# EAGLE design Blinkytile tester (EAGLE 7.1.0)
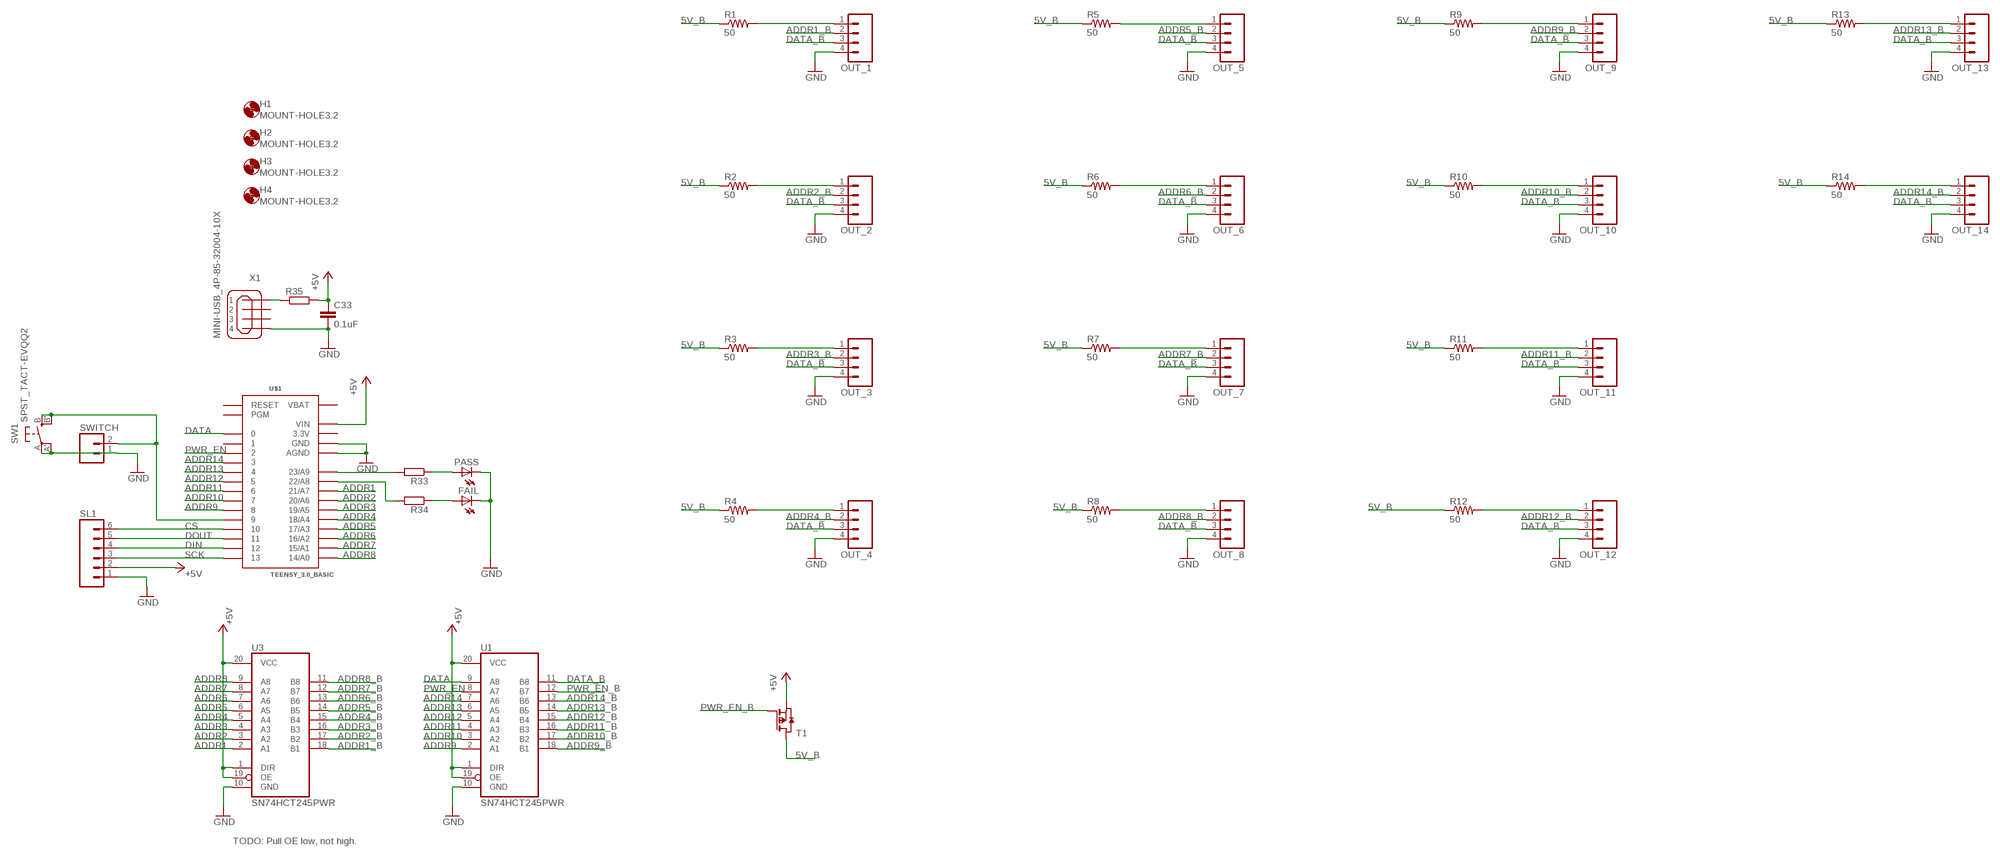
[diagram p0: schematic, sheet 1]

## Parts
C33  0.1uF  C-EUC0805  [C0805]
FAIL  LED5MM  [LED5MM]
H1  MOUNT-HOLE3.2  [3,2]
H2  MOUNT-HOLE3.2  [3,2]
H3  MOUNT-HOLE3.2  [3,2]
H4  MOUNT-HOLE3.2  [3,2]
OUT_1  M04  [04P]
OUT_2  M04  [04P]
OUT_3  M04  [04P]
OUT_4  M04  [04P]
OUT_5  M04  [04P]
OUT_6  M04  [04P]
OUT_7  M04  [04P]
OUT_8  M04  [04P]
OUT_9  M04  [04P]
OUT_10  M04  [04P]
OUT_11  M04  [04P]
OUT_12  M04  [04P]
OUT_13  M04  [04P]
OUT_14  M04  [04P]
PASS  LED5MM  [LED5MM]
R1  50  R-US_R0603  [R0603]
R2  50  R-US_R0603  [R0603]
R3  50  R-US_R0603  [R0603]
R4  50  R-US_R0603  [R0603]
R5  50  R-US_R0603  [R0603]
R6  50  R-US_R0603  [R0603]
R7  50  R-US_R0603  [R0603]
R8  50  R-US_R0603  [R0603]
R9  50  R-US_R0603  [R0603]
R10  50  R-US_R0603  [R0603]
R11  50  R-US_R0603  [R0603]
R12  50  R-US_R0603  [R0603]
R13  50  R-US_R0603  [R0603]
R14  50  R-US_R0603  [R0603]
R33  R-EU_M0805  [M0805]
R34  R-EU_M0805  [M0805]
R35  R-EU_M0805  [M0805]
SL1  M06  [06P]
SW1  SPST_TACT-EVQQ2  [EVQ-Q2]
SWITCH  M02  [02P]
T1  PMOSSOT223  [SOT223]
U1  SN74HCT245PWR  74245PW  [TSSOP20]
U3  SN74HCT245PWR  74245PW  [TSSOP20]
U$1  TEENSY_3.0_BASIC  [TEENSY_3.0_BASIC]
X1  MINI-USB_4P-85-32004-10X  [85-32004-10X]

## Nets
5V_B: R1.1 R2.1 R3.1 R4.1 R5.1 R6.1 R7.1 R8.1 R9.1 R10.1 R11.1 R12.1 R13.1 R14.1 T1.2(D) T1.4(D)
+5V: C33.1 R35.2 SL1.2 T1.3(S) U1.1(DIR) U1.19(OE) U1.20(VCC) U3.1(DIR) U3.19(OE) U3.20(VCC) U$1.VIN
ADDR1: U3.2(A1) U$1.21/A7
ADDR1_B: OUT_1.2 U3.18(B1)
ADDR2: U3.3(A2) U$1.20/A6
ADDR2_B: OUT_2.2 U3.17(B2)
ADDR3: U3.4(A3) U$1.19/A5
ADDR3_B: OUT_3.2 U3.16(B3)
ADDR4: U3.5(A4) U$1.18/A4
ADDR4_B: OUT_4.2 U3.15(B4)
ADDR5: U3.6(A5) U$1.17/A3
ADDR5_B: OUT_5.2 U3.14(B5)
ADDR6: U3.7(A6) U$1.16/A2
ADDR6_B: OUT_6.2 U3.13(B6)
ADDR7: U3.8(A7) U$1.15/A1
ADDR7_B: OUT_7.2 U3.12(B7)
ADDR8: U3.9(A8) U$1.14/A0
ADDR8_B: OUT_8.2 U3.11(B8)
ADDR9: U1.2(A1) U$1.8
ADDR9_B: OUT_9.2 U1.18(B1)
ADDR10: U1.3(A2) U$1.7
ADDR10_B: OUT_10.2 U1.17(B2)
ADDR11: U1.4(A3) U$1.6
ADDR11_B: OUT_11.2 U1.16(B3)
ADDR12: U1.5(A4) U$1.5
ADDR12_B: OUT_12.2 U1.15(B4)
ADDR13: U1.6(A5) U$1.4
ADDR13_B: OUT_13.2 U1.14(B5)
ADDR14: U1.7(A6) U$1.3
ADDR14_B: OUT_14.2 U1.13(B6)
CS: SL1.6 U$1.10
DATA: U1.9(A8) U$1.0
DATA_B: OUT_1.3 OUT_2.3 OUT_3.3 OUT_4.3 OUT_5.3 OUT_6.3 OUT_7.3 OUT_8.3 OUT_9.3 OUT_10.3 OUT_11.3 OUT_12.3 OUT_13.3 OUT_14.3 U1.11(B8)
DIN: SL1.4 U$1.12
DOUT: SL1.5 U$1.11
GND: C33.2 FAIL.K(C) OUT_1.4 OUT_2.4 OUT_3.4 OUT_4.4 OUT_5.4 OUT_6.4 OUT_7.4 OUT_8.4 OUT_9.4 OUT_10.4 OUT_11.4 OUT_12.4 OUT_13.4 OUT_14.4 PASS.K(C) SL1.1 SW1.A'(P1) SW1.A(P) SWITCH.1 U1.10(GND) U3.10(GND) U$1.AGND U$1.GND U$1.GND1(GND) X1.4
GOOD: PASS.A R33.1
N$1: OUT_5.1 R5.2
N$2: OUT_1.1 R1.2
N$3: SW1.B'(S1) SW1.B(S) SWITCH.2 U$1.9
N$4: OUT_2.1 R2.2
N$8: OUT_3.1 R3.2
N$11: OUT_4.1 R4.2
N$17: OUT_6.1 R6.2
N$20: OUT_7.1 R7.2
N$23: OUT_8.1 R8.2
N$26: OUT_9.1 R9.2
N$29: OUT_10.1 R10.2
N$32: OUT_11.1 R11.2
N$38: OUT_13.1 R13.2
N$41: OUT_14.1 R14.2
N$44: OUT_12.1 R12.2
N$49: R33.2 U$1.23/A9
N$50: R34.2 U$1.22/A8
N$52: FAIL.A R34.1
N$53: R35.1 X1.1
PWR_EN: U1.8(A7) U$1.2
PWR_EN_B: T1.1(G) U1.12(B7)
SCK: SL1.3 U$1.13
Unconnected: U$1.1 U$1.PGM U$1.RESET X1.2 X1.3

## Notes on the sheet
- TODO: Pull OE low, not high.

## Power pins joined to a net without a drawn wire
3.3V: U$1.3.3V U$1.3.3V1(3.3V)
VBAT: U$1.VBAT

## Library data of the parts
C33 = rcl:C-EU: CAPACITOR, European symbol
FAIL PASS = adafruit:LED: LED OSRAM: - CHIPLED LG R971, LG N971, LY N971, LG Q971, LY Q971, LO R971, LY R971 LH N974, LH R974 LS Q976, LO Q976, LY Q976 LO Q996 - Hyper CHIPLED LW Q18S LB Q993, LB Q99A, LB R99A - SideLED LS A670, LO A670, LY A670, LG A670, LP A670 LB A673, LV A673, LT A673, LW A673 LH A674 LY A675 LS A676, LA A676, LO A676, LY A676, LW A676 LS A679, LY A679, LG A679 - Hyper Micro SIDELED® LS Y876, LA Y876, LO Y876, LY Y876 LT Y87S - SmartLED LW L88C, LW L88S LB L89C, LB L89S, LG L890 LS L89K, LO L89K, LY L89K LS L896, LA L896, LO L896, LY L896 - TOPLED LS T670, LO T670, LY T670, LG T670, LP T670 LSG T670, LSP T670, LSY T670, LOP T670, LYG T670 LG T671, LOG T671, LSG T671 LB T673, LV T673, LT T673, LW T673 LH T674 LS T676, LA T676, LO T676, LY T676, LB T676, LH T676, LSB T676, LW T676 LB T67C, LV T67C, LT T67C, LS T67K, LO T67K, LY T67K, LW E67C LS E67B, LA E67B, LO E67B, LY E67B, LB E67C, LV E67C, LT E67C LW T67C LS T679, LY T679, LG T679 LS T770, LO T770, LY T770, LG T770, LP T770 LB T773, LV T773, LT T773, LW T773 LH T774 LS E675, LA E675, LY E675, LS T675 LS T776, LA T776, LO T776, LY T776, LB T776 LHGB T686 LT T68C, LB T68C - Hyper Mini TOPLED® LB M676 - Mini TOPLED Santana® LG M470 LS M47K, LO M47K, LY M47K Source: http://www.osram.convergy.de/
H1-H4 = holes:MOUNT-HOLE: MOUNTING HOLE with drill center marker
OUT_1-OUT_14 = con-amp-quick:M04: AMP QUICK CONNECTOR; OC_FARNELL: unknown; OC_NEWARK: unknown
R1-R14 = adafruit:R-US_: RESISTOR, American symbol
R33-R35 = rcl:R-EU_: RESISTOR, European symbol
SL1 = con-amp-quick:M06: AMP QUICK CONNECTOR; OC_FARNELL: unknown; OC_NEWARK: unknown
SW1 = adafruit:SPST_TACT: SMT 6mm switch, EVQQ2 series http://www.ladyada.net/library/eagle
SWITCH = con-amp-quick:M02: AMP QUICK CONNECTOR; OC_FARNELL: unknown; OC_NEWARK: unknown
T1 = zetex:PMOSSOT223: MOS FET; OC_FARNELL: unknown; OC_NEWARK: unknown
U1 U3 = scanlime:74*245: Octal BUS TRANSCEIVER, 3-state
U$1 = Teensy3.0:TEENSY_3.0_BASIC: Basic Teensy 3.0 with none of the 'inner' pins enabled. See '+4', 'AllAnalogPins", and 'AllPins' packages for additional pin holes, as needed.
X1 = con-cypressindustries:MINI-USB_4P-: MINI USB 4 Pol. Source: www.cypressindustries.com; OC_FARNELL: unknown; OC_NEWARK: unknown

## Board
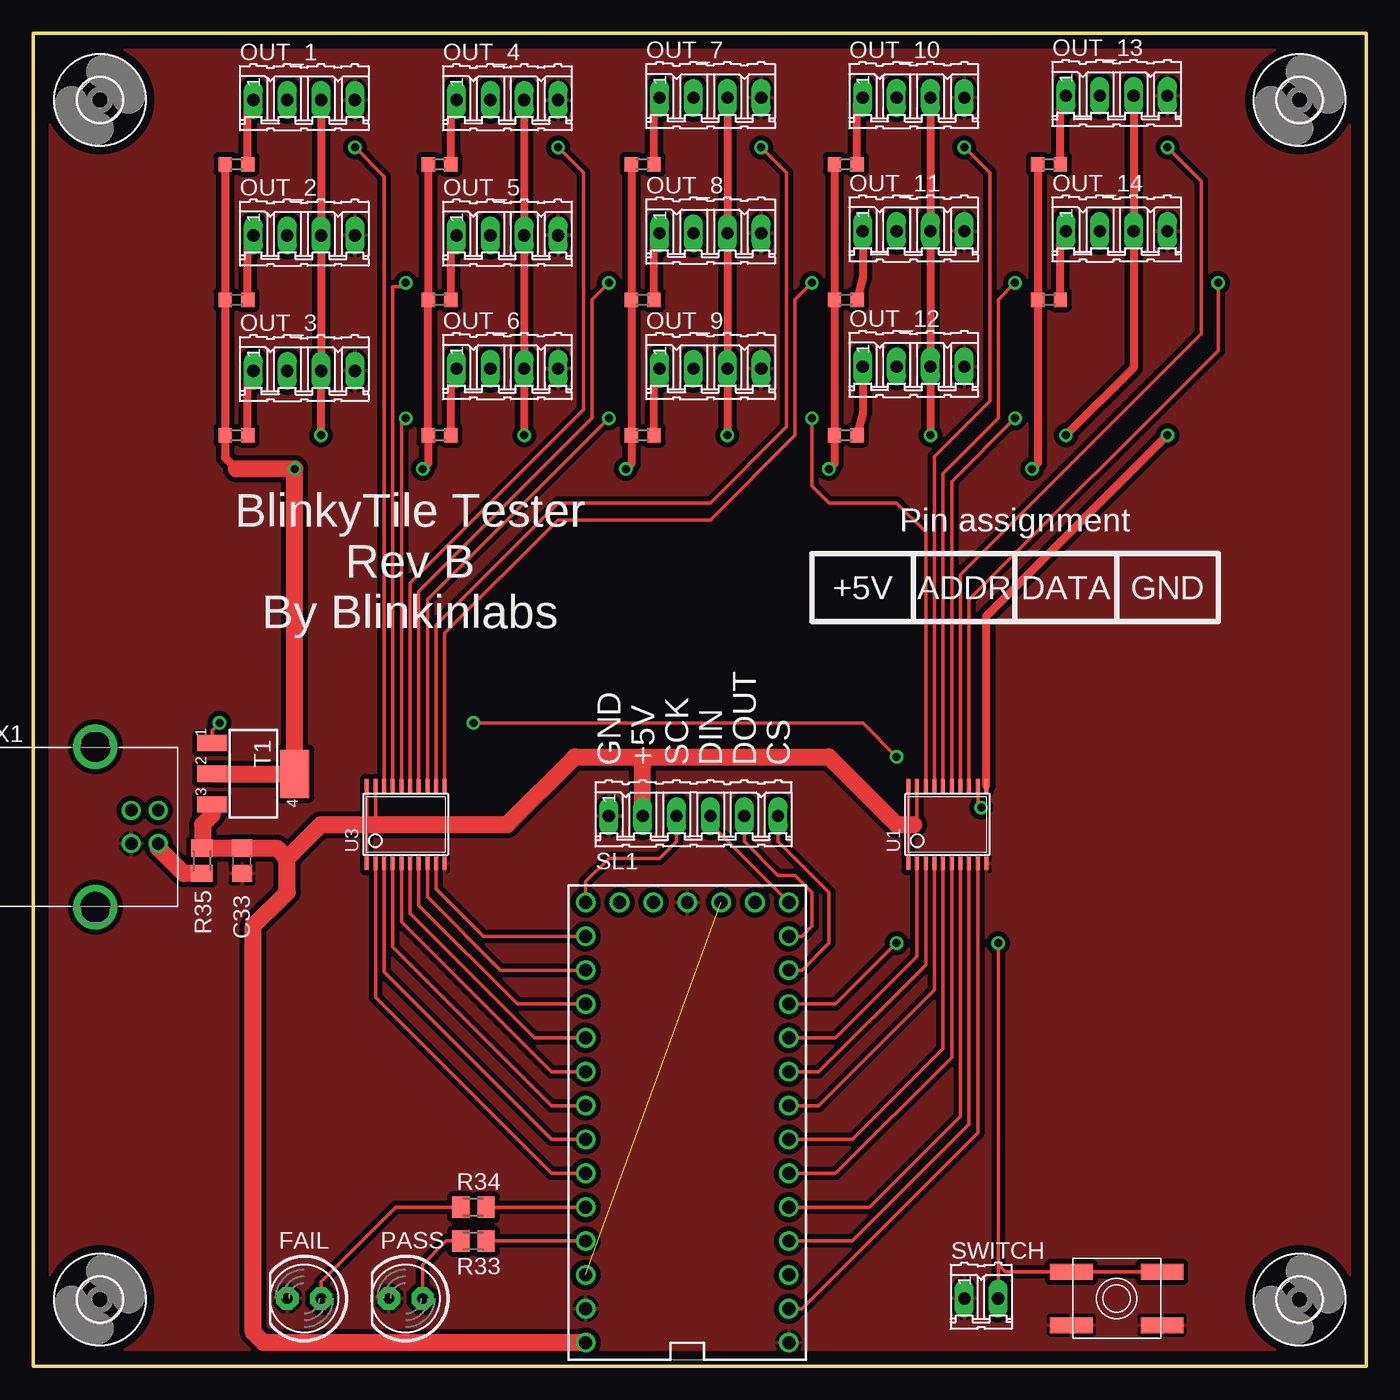
[diagram p1: board, top side]
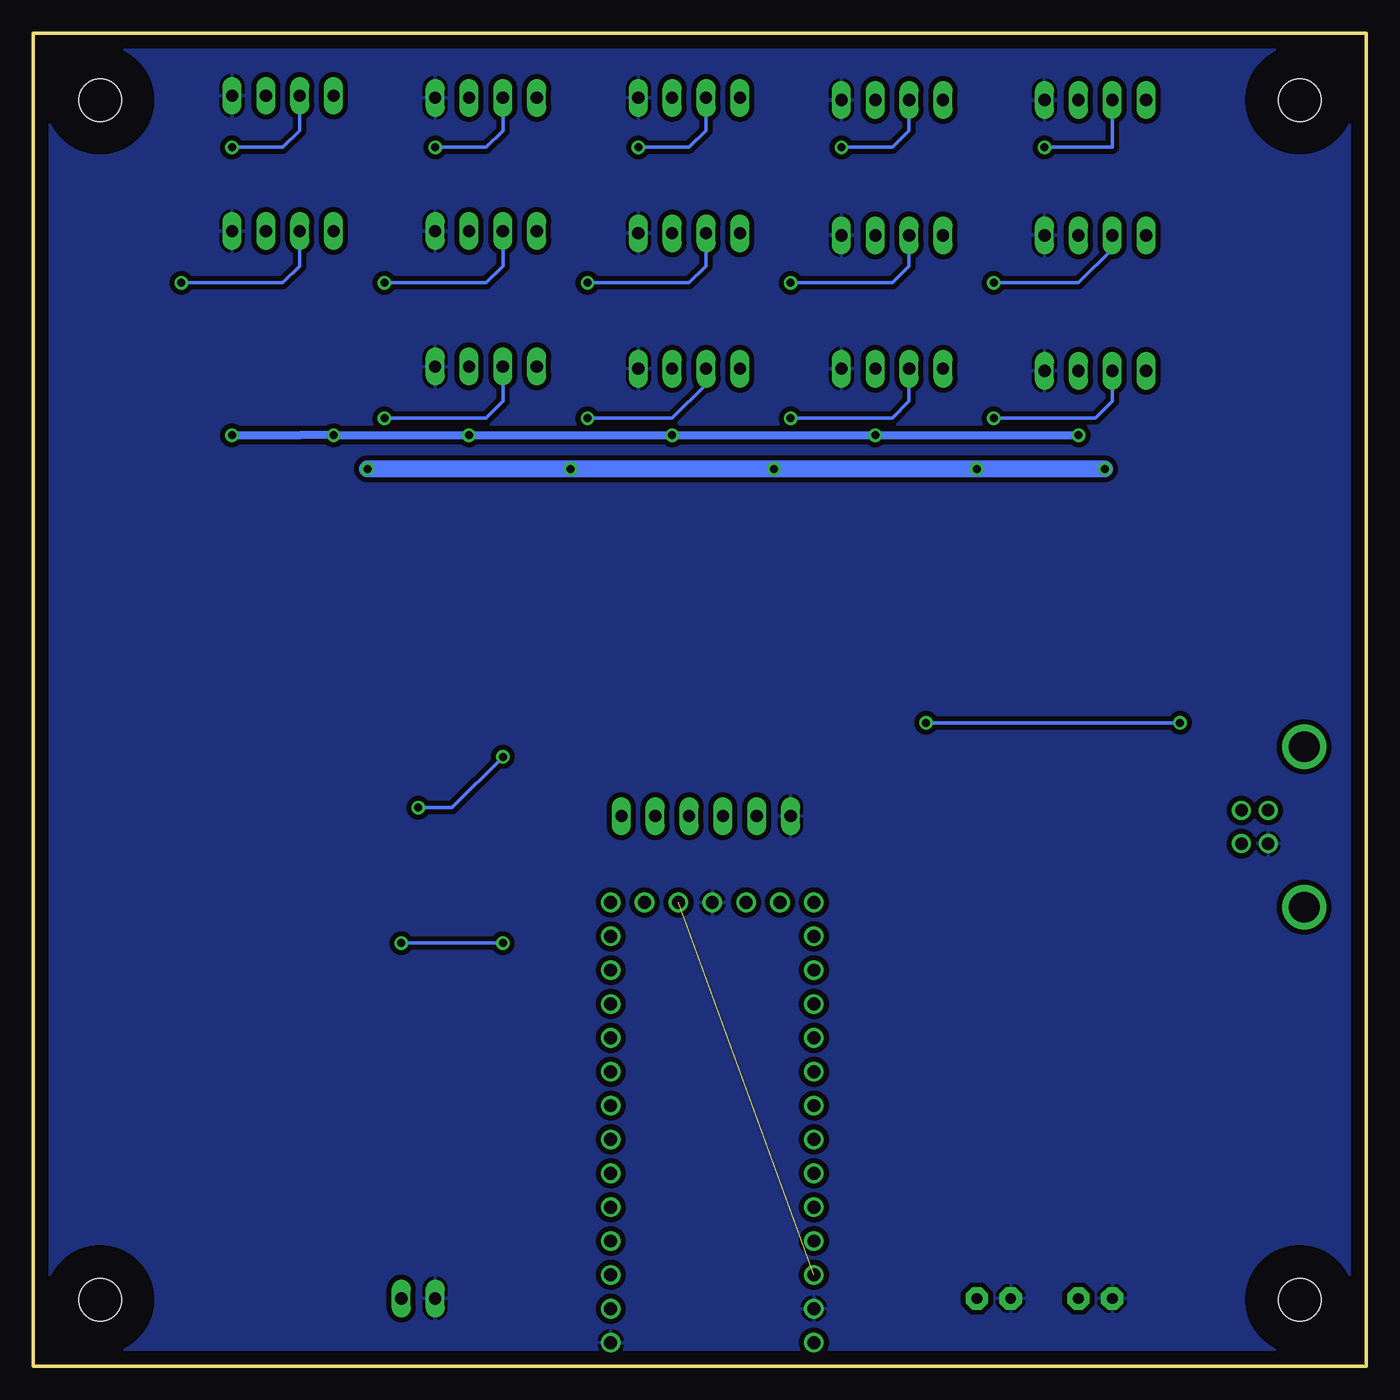
[diagram p2: board, bottom side, seen from below]

Size 100 x 100 mm. Coordinates in mm from the lower left corner, seen from the top.
Outline: 0,0 100,0 100,100 0,100 0,0
Copper layers (1*16): Top 0.035mm / dielectric 1.5mm / Bottom 0.035mm
Design rules "default": minimum track width 10mil, minimum drill 24mil, track to track 15mil, track to pad 15mil, pad to pad 8mil, via to via 8mil, smd to smd 8mil, copper to edge 40mil, drill to drill 8mil, minimum pad ring 10mil, minimum via ring 8mil, stop-mask expansion 4mil, vias tented up to drill 8mil, thermal gap 10mil

### Footprints (pad centres in the part's own frame; a part is rotated, then mirrored left to right if it is on the bottom)
C0805 = smd 1.3 x 1.5: 1 -0.95,0; 2 0.95,0
LED5MM = drill 0.813 pad 1.676 octagon: A -1.27,0; K 1.27,0
3,2 = hole 3.2: 0,0
04P = drill 0.914 long: 1 -3.81,0; 2 -1.27,0; 3 1.27,0; 4 3.81,0
R0603 = smd 1 x 1.1: 1 -0.85,0; 2 0.85,0
M0805 = smd 1.3 x 1.6: 1 -0.95,0; 2 0.95,0
06P = drill 0.914 long: 1 -6.35,0; 2 -3.81,0; 3 -1.27,0; 4 1.27,0; 5 3.81,0; 6 6.35,0
EVQ-Q2 = smd 3.2 x 1.2: A -3.4,-2; A' 3.4,-2; B -3.4,2; B' 3.4,2
02P = drill 0.914 long: 1 -1.27,0; 2 1.27,0
SOT223 = smd 1.219 x 2.235: 1 -2.311,-3.099; 2 0,-3.099; 3 2.311,-3.099 | smd 3.6 x 2.2: 4 0,3.099
TSSOP20 = smd 0.305 x 0.991: 1 -2.925,-2.918; 2 -2.275,-2.918; 3 -1.625,-2.918; 4 -0.975,-2.918; 5 -0.325,-2.918; 6 0.325,-2.918; 7 0.975,-2.918; 8 1.625,-2.918; 9 2.275,-2.918; 10 2.925,-2.918; 11 2.925,2.918; 12 2.275,2.918; 13 1.625,2.918; 14 0.975,2.918; 15 0.325,2.918; 16 -0.325,2.918; 17 -0.975,2.918; 18 -1.625,2.918; 19 -2.275,2.918; 20 -2.925,2.918
TEENSY_3.0_BASIC = drill 0.965: 0 -7.62,13.97; 1 -7.62,11.43; 2 -7.62,8.89; 3 -7.62,6.35; 3.3V 7.62,11.43; 3.3V1 -2.54,-16.51; 4 -7.62,3.81; 5 -7.62,1.27; 6 -7.62,-1.27; 7 -7.62,-3.81; 8 -7.62,-6.35; 9 -7.62,-8.89; 10 -7.62,-11.43; 11 -7.62,-13.97; 12 -7.62,-16.51; 13 7.62,-16.51; 14/A0 7.62,-13.97; 15/A1 7.62,-11.43; 16/A2 7.62,-8.89; 17/A3 7.62,-6.35; 18/A4 7.62,-3.81; 19/A5 7.62,-1.27; 20/A6 7.62,1.27; 21/A7 7.62,3.81; 22/A8 7.62,6.35; 23/A9 7.62,8.89; AGND 7.62,13.97; GND -7.62,16.51; GND1 0,-16.51; PGM 2.54,-16.51; RESET 5.08,-16.51; VBAT -5.08,-16.51; VIN 7.62,16.51
85-32004-10X = drill 0.92 pad 1.27: 1 4.71,-1.25; 2 4.71,1.25; 3 2.71,1.25; 4 2.71,-1.25 | drill 2.3 pad 3: M1 0,6.02; M2 0,-6.02

### Placement (x,y rotation side)
C33  15.65,37.91 270 top
FAIL  20.32,5.08 180 top
H1  5,5 0 top
H2  5,95 0 top
H3  95,95 0 top
H4  95,5 0 top
OUT_1  20.32,95 0 top
OUT_2  20.32,84.84 0 top
OUT_3  20.32,74.68 0 top
OUT_4  35.56,95 0 top
OUT_5  35.56,84.84 0 top
OUT_6  35.56,74.84 0 top
OUT_7  50.8,95.16 0 top
OUT_8  50.8,85 0 top
OUT_9  50.8,74.84 0 top
OUT_10  66.04,95.16 0 top
OUT_11  66.04,85.16 0 top
OUT_12  66.04,75 0 top
OUT_13  81.28,95.32 0 top
OUT_14  81.28,85.16 0 top
PASS  27.94,5.08 180 top
R1  15.24,90.17 0 top
R2  15.24,80.01 0 top
R3  15.24,69.85 0 top
R4  30.48,90.17 0 top
R5  30.48,80.01 0 top
R6  30.48,69.85 0 top
R7  45.72,90.17 0 top
R8  45.72,80.01 0 top
R9  45.72,69.85 0 top
R10  60.96,90.17 0 top
R11  60.96,80.01 0 top
R12  60.96,69.85 0 top
R13  76.2,90.17 0 top
R14  76.2,80.01 0 top
R33  33.02,9.39 0 top
R34  33.02,11.93 0 top
R35  12.65,37.91 90 top
SL1  49.53,41.27 0 top
SW1  81.28,5.08 0 top
SWITCH  71.12,5.08 0 top
T1  16.51,44.45 270 top
U1  68.58,40.64 0 top
U3  27.94,40.64 0 top
U$1  49.06,18.28 180 top
X1  4.65,40.45 0 top

### Tracks (layer width: path | path; a pad name or v marks a point on that pad's centre or on a via)
3.3V  (1 unrouted)
5V_B  (via drill 0.6)
  Top 0.61: R1.1 R2.1 R3.1 14.39,68.16 15.24,67.31 | R13.1 R14.1 75.35,67.73 v74.93,67.31 | R10.1 R11.1 R12.1 60.11,67.73 v59.69,67.31 | R4.1 R5.1 R6.1 29.63,67.73 v29.21,67.31 | R7.1 R8.1 R9.1 44.87,67.73 v44.45,67.31
  Top 1.27: 15.24,67.31 v19.61,67.31 T1.4 T1.2
  Bottom 1.27: v19.61,67.31 v29.21,67.31 v44.45,67.31 v59.69,67.31 v74.93,67.31
+5V
  Top 0.254: U3.20 25.02,41.02 25.4,40.64 | U3.19 25.66,40.91 25.4,40.64 | U3.1 25.02,40.26 25.4,40.64 | U1.19 66.31,40.91 66.04,40.64 | U1.20 65.66,41.02 66.04,40.64 | U1.1 65.66,40.26 66.04,40.64
  Top 1.27: T1.3 13.41,41.35 12.7,40.64 12.7,38.91 R35.2 C33.1 18.29,38.87 19.05,38.1 | U$1.VIN 17.28,1.77 16.51,2.54 16.51,33.02 19.05,35.56 19.05,38.1 | 19.05,38.1 21.59,40.64 25.4,40.64 35.56,40.64 40.64,45.72 45.72,45.72 | 45.72,45.72 59.69,45.72 64.77,40.64 66.04,40.64 | SL1.2 45.72,45.72
ADDR1
  Top 0.254: U3.2 25.66,27.68 38.87,14.47 U$1.21/A7
ADDR1_B  (via drill 0.6)
  Top 0.254: U3.18 26.32,89.25 v24.13,91.44
  Bottom 0.254: v24.13,91.44 19.05,91.44 OUT_1.2
ADDR2
  Top 0.254: U3.3 26.32,29.57 38.87,17.01 U$1.20/A6
ADDR2_B  (via drill 0.6)
  Top 0.254: U3.17 26.96,80.98 27.64,80.98 v27.94,81.28
  Bottom 0.254: v27.94,81.28 21.59,81.28 19.05,83.82 OUT_2.2
ADDR3
  Top 0.254: U3.4 26.96,31.45 38.87,19.55 U$1.19/A5
ADDR3_B  (via drill 0.6)
  Top 0.254: U3.16 27.61,70.8 v27.94,71.12
  Bottom 0.254: v27.94,71.12 20.32,71.12 19.05,72.39 OUT_3.2
ADDR4
  Top 0.254: U3.5 27.61,33.34 38.87,22.09 U$1.18/A4
ADDR4_B  (via drill 0.6)
  Top 0.254: U3.15 28.27,58.74 41.27,71.75 41.27,89.53 v39.37,91.44
  Bottom 0.254: v39.37,91.44 35.56,91.44 34.29,92.71 OUT_4.2
ADDR5
  Top 0.254: U3.6 28.27,33.97 37.6,24.63 U$1.17/A3
ADDR5_B  (via drill 0.6)
  Top 0.254: U3.14 28.91,58.12 41.91,71.12 41.91,80.01 v43.18,81.28
  Bottom 0.254: v43.18,81.28 35.56,81.28 34.29,82.55 OUT_5.2
ADDR6
  Top 0.254: U3.7 28.91,34.59 36.33,27.17 U$1.16/A2
ADDR6_B  (via drill 0.6)
  Top 0.254: U3.13 29.57,57.51 v43.18,71.12
  Bottom 0.254: v43.18,71.12 35.56,71.12 34.29,72.39 OUT_6.2
ADDR7
  Top 0.254: U3.8 29.57,35.2 35.06,29.71 U$1.15/A1
ADDR7_B  (via drill 0.6)
  Top 0.254: U3.12 30.21,55.62 39.37,64.77 50.8,64.77 56.52,70.48 56.52,89.53 v54.61,91.44
  Bottom 0.254: v54.61,91.44 50.8,91.44 49.53,92.71 OUT_7.2
ADDR8
  Top 0.254: U$1.14/A0 33.79,32.25 30.21,35.83 U3.9
ADDR8_B  (via drill 0.6)
  Top 0.254: U3.11 30.86,54.99 39.37,63.5 50.8,63.5 57.15,69.85 57.15,80.01 v58.42,81.28
  Bottom 0.254: v58.42,81.28 50.8,81.28 49.53,82.55 OUT_8.2 49.53,85.09
ADDR9
  Top 0.254: U1.2 66.31,30.75 60.19,24.63 U$1.8
ADDR9_B  (via drill 0.6)
  Top 0.254: U1.18 66.95,62.59 64.77,64.77 59.69,64.77 58.42,66.04 v58.42,71.12
  Bottom 0.254: v58.42,71.12 52.07,71.12 49.53,73.66 OUT_9.2
ADDR10
  Top 0.254: U1.3 66.95,30.12 58.92,22.09 U$1.7
ADDR10_B  (via drill 0.6)
  Top 0.254: U1.17 67.61,68.24 71.75,72.39 71.75,89.53 v69.85,91.44
  Bottom 0.254: v69.85,91.44 66.04,91.44 64.77,92.71 OUT_10.2
ADDR11
  Top 0.254: U1.4 67.61,28.23 58.92,19.55 U$1.6
ADDR11_B  (via drill 0.6)
  Top 0.254: U1.16 68.25,66.98 72.39,71.12 72.39,80.01 v73.66,81.28
  Bottom 0.254: v73.66,81.28 66.04,81.28 64.77,82.55 OUT_11.2
ADDR12
  Top 0.254: U1.5 68.25,23.8 61.46,17.01 U$1.5
ADDR12_B  (via drill 0.6)
  Top 0.254: U1.15 68.91,66.36 v73.66,71.12
  Bottom 0.254: v73.66,71.12 66.04,71.12 64.77,72.39 OUT_12.2
ADDR13
  Top 0.254: U1.6 68.91,23.18 60.19,14.47 U$1.4
ADDR13_B  (via drill 0.6)
  Top 0.254: U1.14 69.56,59.4 87.63,77.47 87.63,88.9 v85.09,91.44
  Bottom 0.254: v85.09,91.44 81.28,91.44 80.01,92.71 OUT_13.2
ADDR14
  Top 0.254: U1.7 69.56,18.75 62.73,11.93 U$1.3
ADDR14_B  (via drill 0.6)
  Top 0.254: U1.13 70.2,57.51 88.9,76.2 v88.9,81.28
  Bottom 0.254: v88.9,81.28 81.28,81.28 80.01,82.55 OUT_14.2
CS
  Top 0.254: SL1.6 55.88,39.37 59.69,35.56 59.69,31.75 57.65,29.71 U$1.10
DATA
  Top 0.254: U1.9 70.86,17.52 57.65,4.31 U$1.0
DATA_B  (via drill 0.6)
  Top 0.61: OUT_1.3 OUT_2.3 OUT_3.3 v21.59,69.85 | OUT_4.3 OUT_5.3 OUT_6.3 v36.83,69.85 | OUT_7.3 OUT_8.3 OUT_9.3 v52.07,69.85 | OUT_10.3 OUT_11.3 OUT_12.3 v67.31,69.85 | U1.11 71.5,56.27 v85.09,69.85 | v77.47,69.85 82.55,74.93 OUT_14.3 OUT_13.3
  Bottom 0.61: v85.09,69.85 80.01,69.85 v77.47,69.85 v67.31,69.85 v52.07,69.85 v36.83,69.85 v21.59,69.85
DIN
  Top 0.254: SL1.4 50.8,40.67 U$1.12
DOUT
  Top 0.254: SL1.5 53.34,39.37 55.88,36.83 57.15,36.83 58.42,35.56 58.42,33.02 57.65,32.25 U$1.11
GND
  pour Top: 0,100 100,100 100,0 0,0
  pour Bottom: 0,100 0,0 100,0 100,100
GOOD
  Top 0.254: R33.1 30.98,9.39 29.21,7.62 PASS.A
N$1
  Top 0.61: R5.2 31.33,84.42 OUT_5.1
N$2
  Top 0.61: R1.2 16.09,94.58 OUT_1.1
N$3  (via drill 0.6)
  Top 0.254: U$1.9 60.19,27.17 v64.77,31.75 | v72.39,31.75 72.39,7.62 | 72.39,7.62 SWITCH.2 | SW1.B' SW1.B 72.93,7.08 72.39,7.62
  Bottom 0.254: v64.77,31.75 v72.39,31.75
N$4
  Top 0.61: R2.2 16.09,84.42 OUT_2.1
N$8
  Top 0.61: R3.2 16.09,74.26 OUT_3.1
N$11
  Top 0.61: R4.2 31.33,94.58 OUT_4.1
N$17
  Top 0.61: R6.2 31.33,74.42 OUT_6.1
N$20
  Top 0.61: R7.2 46.57,94.74 OUT_7.1
N$23
  Top 0.61: R8.2 46.57,84.58 OUT_8.1
N$26
  Top 0.61: R9.2 46.57,74.42 OUT_9.1
N$29
  Top 0.61: R10.2 61.81,94.74 OUT_10.1
N$32
  Top 0.61: OUT_11.1 62.23,81.7 R11.2
N$38
  Top 0.61: R13.2 77.05,94.9 OUT_13.1
N$41
  Top 0.61: R14.2 77.05,84.74 OUT_14.1
N$44
  Top 0.61: OUT_12.1 62.23,71.54 R12.2
N$49
  Top 0.254: U$1.23/A9 R33.2
N$50
  Top 0.254: U$1.22/A8 R34.2
N$52
  Top 0.254: R34.1 27.17,11.93 21.59,6.35 FAIL.A
N$53
  Top 1.27: X1.1 9.36,38.9 11.29,36.97 R35.1
PWR_EN
  Top 0.254: U1.8 70.2,18.14 61.46,9.39 U$1.2
PWR_EN_B  (via drill 0.6)
  Top 0.254: U1.12 70.86,42.17 v71.12,41.91 | v64.77,45.72 62.23,48.26 v33.02,48.26 | v13.97,48.26 13.41,47.7 T1.1
  Bottom 0.254: v71.12,41.91 68.58,41.91 v64.77,45.72 | v33.02,48.26 v13.97,48.26
SCK
  Top 0.254: U$1.13 41.44,36.36 43.18,38.1 46.99,38.1 48.26,39.37 SL1.3

### Text on the board
tNames: Pin assignment | BlinkyTile Tester / Rev B / By Blinkinlabs | +5V | ADDR | DATA | GND | GND | +5V | SCK | DIN | DOUT | CS